# Altium schematic sheet [19] - DOC REVISION HISTORY_update 28jun13.SchDoc
size A3; DocumentNumber: 19; SheetNumber: 19; SheetTotal: 20
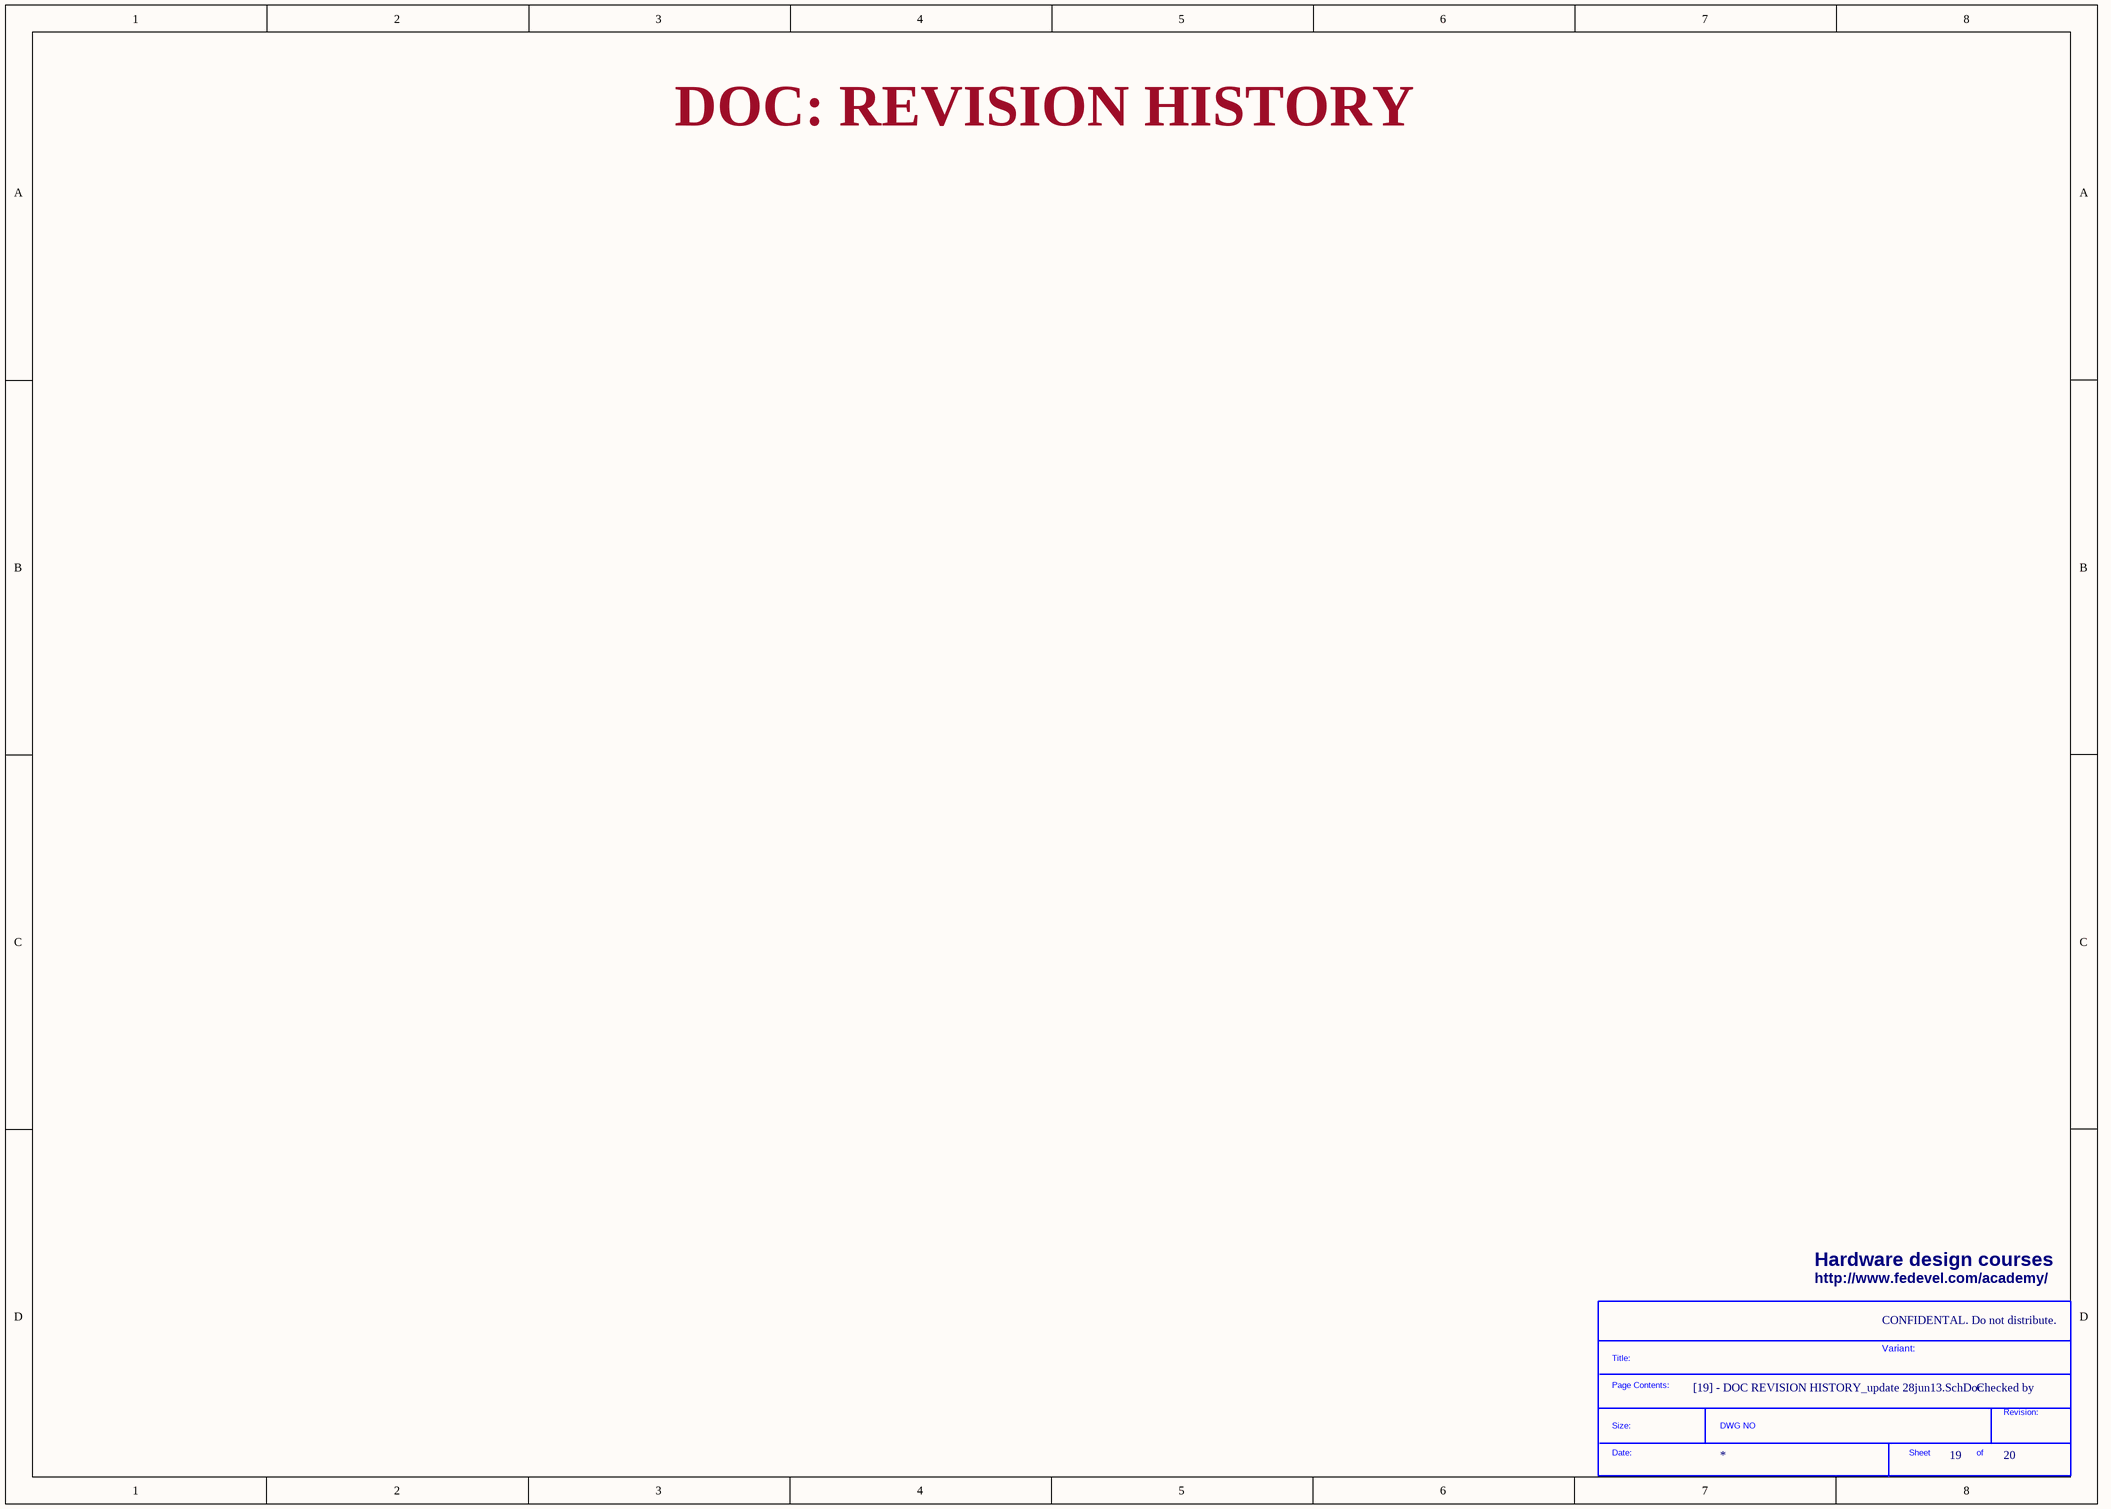
[diagram p0: [19] - DOC REVISION HISTORY_update 28jun13.SchDoc]

## Parts
*  SDTitleBlock  (value not drawn)  (graphical)

## Notes on the sheet
- DOC: REVISION HISTORY
- Hardware design courses
- http://www.fedevel.com/academy/
- CONFIDENTAL. Do not distribute.
- Variant:
- Checked by
- CLOCKS (CPU & PCIE)
- (in symbol SDTitleBlock) Title:; Page Contents:; Revision:; Size:; DWG NO; Date:; Sheet; of